# EAGLE schematic separation (EAGLE 9.6.2)
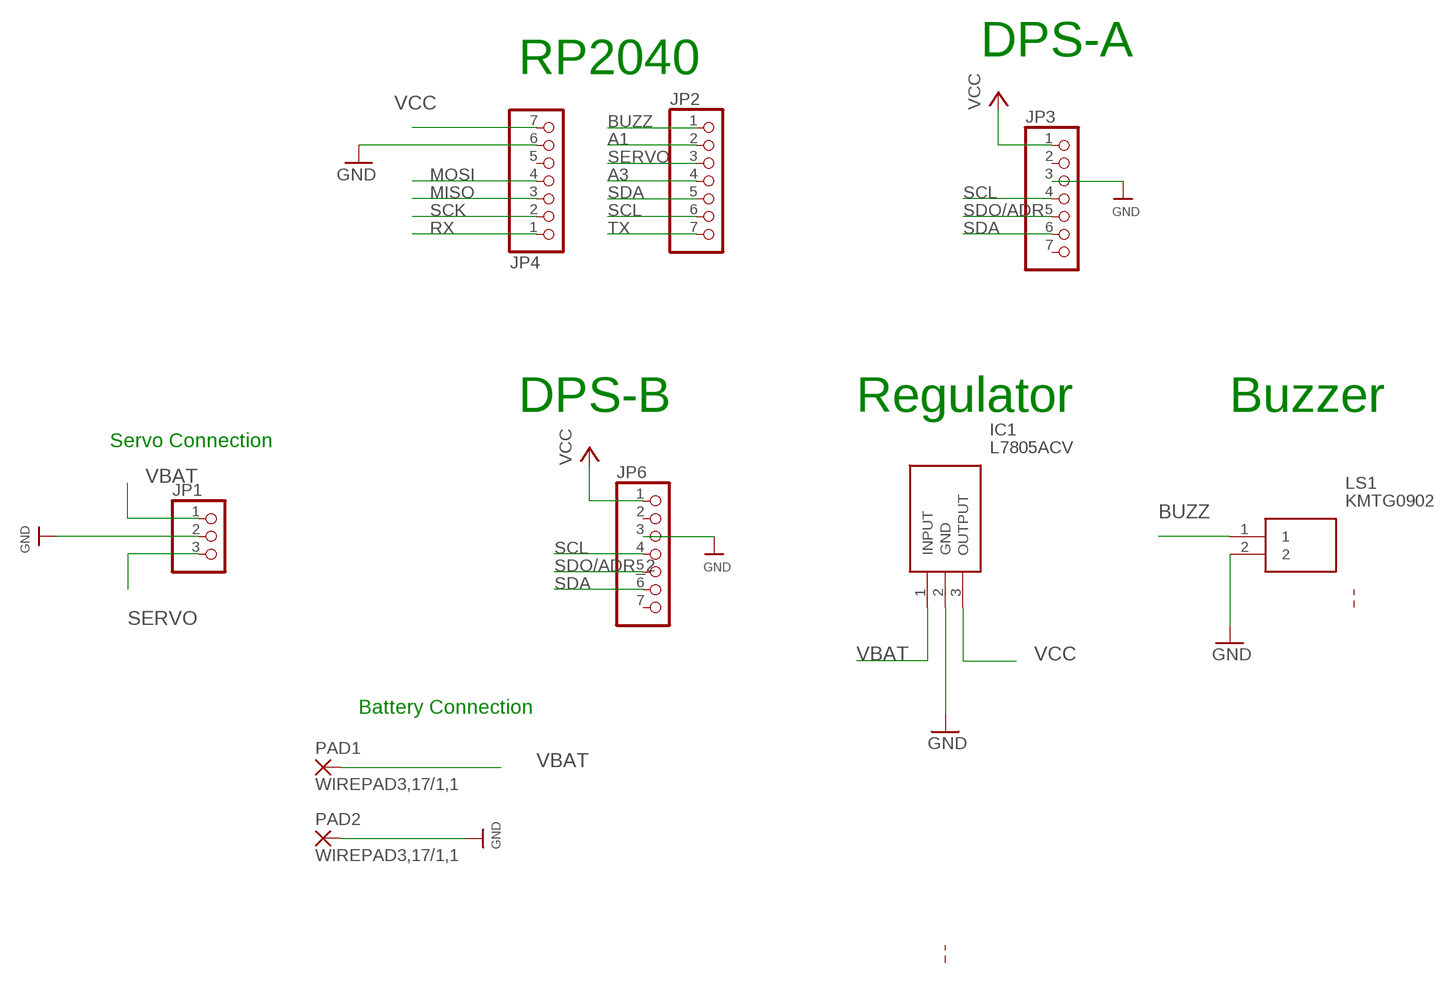
[diagram p0: schematic, sheet 1]

## Parts
IC1  L7805ACV  [TO255P460X1020X2008-3P]
JP1  PINHD-1X3  [1X03]
JP2  HEADER-1X7  [1X07_OVAL]
JP3  HEADER-1X770MIL  [1X07_ROUND_70]
JP4  HEADER-1X7  [1X07_OVAL]
JP6  HEADER-1X770MIL  [1X07_ROUND_70]
LS1  KMTG0902  [KMTG0902]
PAD1  WIREPAD3,17/1,1  [3,17/1,1]
PAD2  WIREPAD3,17/1,1  [3,17/1,1]

## Nets
A1: JP2.2
A3: JP2.4
BUZZ: JP2.1 LS1.1
GND [highpower]: IC1.2(GND) JP1.2 JP3.3 JP4.6 JP6.3 LS1.2 PAD2.1(P)
MISO: JP4.3
MOSI: JP4.4
RX: JP4.1
SCK: JP4.2
SCL: JP2.6 JP3.4 JP6.4
SDA: JP2.5 JP3.6 JP6.6
SDO/ADR: JP3.5
SDO/ADR_2: JP6.5
SERVO: JP1.3 JP2.3
TX: JP2.7
VBAT: IC1.1(INPUT) JP1.1 PAD1.1(P)
VCC [highpower]: IC1.3(OUTPUT) JP3.1 JP4.7 JP6.1
Unconnected: JP3.2 JP3.7 JP4.5 JP6.2 JP6.7

## Notes on the sheet
- DPS-A
- RP2040
- DPS-B | Regulator | Buzzer
- Servo Connection
- Battery Connection

## Library data of the parts
IC1 = SamacSys_Parts:L7805ACV: Linear voltage regulator,L7805ACV 5V 1A STMicroelectronics L7805ACV, Single Linear Voltage Regulator, 1A 5 V, 2%, 3-Pin TO-220 Source: Datasheet <http://uk.rs-online.com/web/p/products/2988508P>; ALLIED_NUMBER: 70013701; DESCRIPTION: Linear voltage regulator,L7805ACV 5V 1A STMicroelectronics L7805ACV, Single Linear Voltage Regulator, 1A 5 V, 2%, 3-Pin TO-220; HEIGHT: 4.6mm; MANUFACTURER_NAME: STMicroelectronics; MANUFACTURER_PART_NUMBER: L7805ACV; RS_PART_NUMBER: 2988508P; RS_PRICE-STOCK: http://uk.rs-online.com/web/p/products/2988508P
JP1 = pinhead:PINHD-1X3: PIN HEADER
JP2-JP4 JP6 = microbuilder:HEADER-1X7: PIN HEADER
LS1 = SamacSys_Parts:KMTG0902: RS PRO 65 (Minimum)dB SMD Square Wave Piezo Buzzer Source: Datasheet; DESCRIPTION: RS PRO 65 (Minimum)dB SMD Square Wave Piezo Buzzer; HEIGHT: 2.2mm; MANUFACTURER_NAME: RS Components; MANUFACTURER_PART_NUMBER: KMTG0902; RS_PART_NUMBER: 1812715; RS_PRICE-STOCK: https://uk.rs-online.com/web/p/products/1812715
PAD1 PAD2 = wirepad:WIREPAD: Wire PAD connect wire on PCB

## Net classes
1 highpower: width 0.305 mm, drill 0.483 mm
2 lowpower: width 0.305 mm, drill 0.483 mm